# Altium schematic sheet B101 PCIe Socket.SchDoc: B101 PCIe Socket
size 292 x 193 mm; SheetNumber: 21; SheetTotal: 21
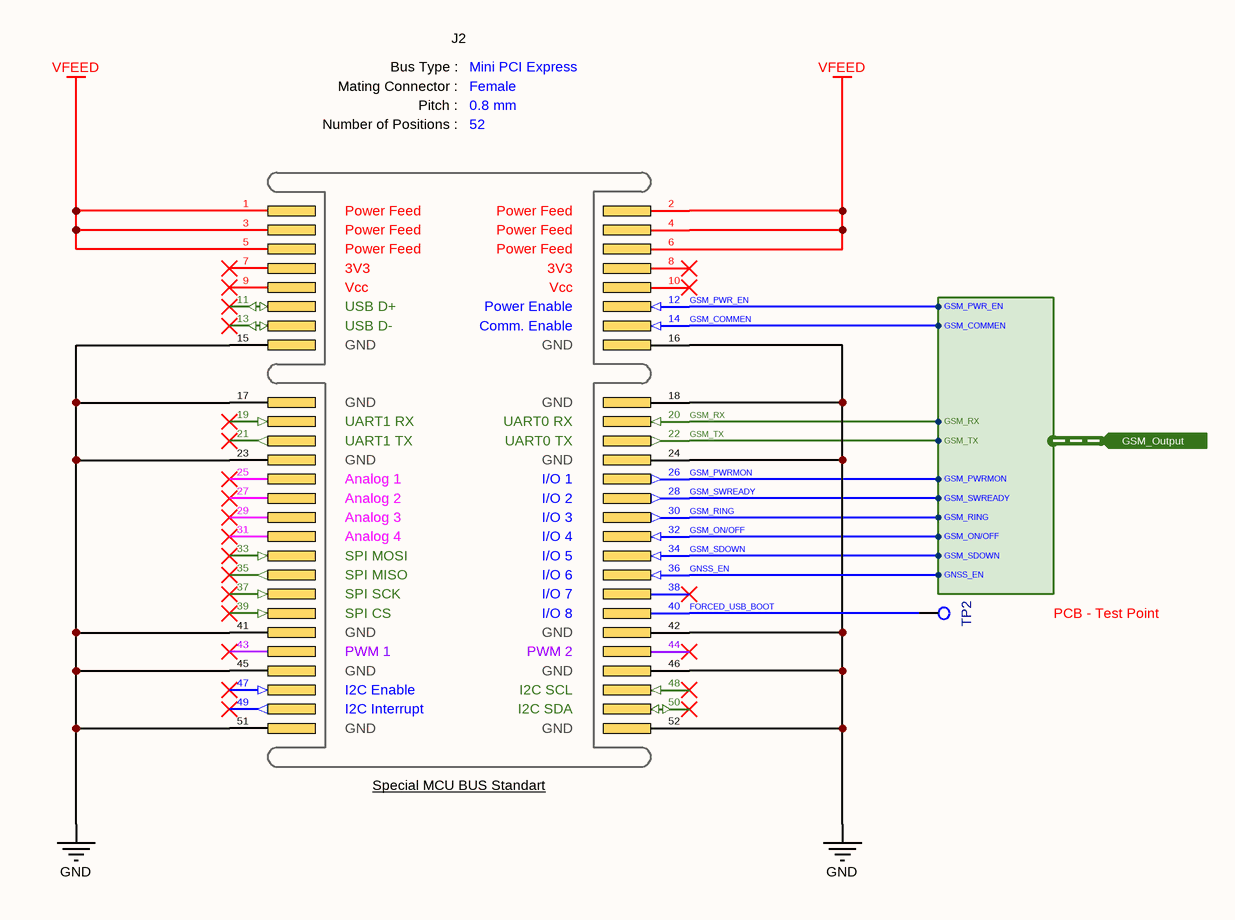
[diagram p0: B101 PCIe Socket.SchDoc]

## Parts
J2  BUS Type: Mini PCI Express  Connector Type: Female  Pitch: 0.8 mm  Number of Positions: 52  [CONNECTOR - Mini PCIe]  (hidden comment: TE-1775862-2)
TP2  PCB - Test Point  [Test_Point]  (no BOM)

## Ports
GSM_Output (in, harness GSM_Output)

## Harnesses
GSM_Output: GSM_SDOWN, GSM_ON/OFF, GSM_TX, GSM_RX, GSM_PWRMON, GSM_SWREADY, GSM_RING, GSM_COMMEN, GSM_PWR_EN, GNSS_EN

## Nets
GND: J2.15(Pin-15) J2.16(Pin-16) J2.17(Pin-17) J2.18(Pin-18) J2.23(Pin-23) J2.24(Pin-24) J2.41(Pin-41) J2.42(Pin-42) J2.45(Pin-45) J2.46(Pin-46) J2.51(Pin-51) J2.52(Pin-52)
VFEED: J2.1(Pin-1) J2.2(Pin-2) J2.3(Pin-3) J2.4(Pin-4) J2.5(Pin-5) J2.6(Pin-6)
FORCED_USB_BOOT: J2.40(Pin-40) TP2.1
GNSS_EN: J2.36(Pin-36) ; port GSM_Output.GNSS_EN
GSM_COMMEN: J2.14(Pin-14) ; port GSM_Output.GSM_COMMEN
GSM_ON/OFF: J2.32(Pin-32) ; port GSM_Output.GSM_ON/OFF
GSM_PWR_EN: J2.12(Pin-12) ; port GSM_Output.GSM_PWR_EN
GSM_PWRMON: J2.26(Pin-26) ; port GSM_Output.GSM_PWRMON
GSM_RING: J2.30(Pin-30) ; port GSM_Output.GSM_RING
GSM_RX: J2.20(Pin-20) ; port GSM_Output.GSM_RX
GSM_SDOWN: J2.34(Pin-34) ; port GSM_Output.GSM_SDOWN
GSM_SWREADY: J2.28(Pin-28) ; port GSM_Output.GSM_SWREADY
GSM_TX: J2.22(Pin-22) ; port GSM_Output.GSM_TX

Not connected (* = marked no-connect by the designer): J2 7(Pin-7)* 8(Pin-8)* 9(Pin-9)* 10(Pin-10)* 11(Pin-11)* 13(Pin-13)* 19(Pin-19)* 21(Pin-21)* 25(Pin-25)* 27(Pin-27)* 29(Pin-29)* 31(Pin-31)* 33(Pin-33)* 35(Pin-35)* 37(Pin-37)* 38(Pin-38)* 39(Pin-39)* 43(Pin-43)* 44(Pin-44)* 47(Pin-47)* 48(Pin-48)* 49(Pin-49)* 50(Pin-50)*

## Notes on the sheet
- © 2021 All rights reserved.
  This document may not, in whole or in part, be copied, photocopied, reproduced, translated or converted to any electronic or machine readable from without prior written permission of Mehmet Günce Akkoyun.
  Engineer contact : akkoyun@me.com
- Property of
- Engineer :
- Date :
- Size :
- A4
- Time :
- Project :
- Page :
- /
- Customer :
- Product ID :
- Module ID :
- Version :
- File :
- Revision :
- (in symbol Connector - Mini PCI-E (Female B101)) Bus Type :; Mating Connector :; Pitch :; Number of Positions :; Power Feed; 3V3; Vcc; USB D+; Power Enable; USB D-; Comm. Enable; GND; UART1 RX; UART0 RX; UART1 TX; UART0 TX; Analog 1; I/O 1; Analog 2; I/O 2; Analog 3; I/O 3; Analog 4; I/O 4; SPI MOSI; I/O 5; SPI MISO; I/O 6; SPI SCK; I/O 7; SPI CS; I/O 8; PWM 1; PWM 2; I2C Enable; I2C SCL; I2C Interrupt; I2C SDA; Special MCU BUS Standart

## Library data of the parts
J2 = Connector - Mini PCI-E (Female B101): Mini PCI-Express female connector.; Manufacturer Name: TE Connectivity; Manufacturer Part Number: TE-1775862-2; System: Connector
TP2 = PCB - Test Point: Test Point; Name: Name